# Altium schematic sheet SCH_BTL.SchDoc
size A; SheetNumber: 1; SheetTotal: 1
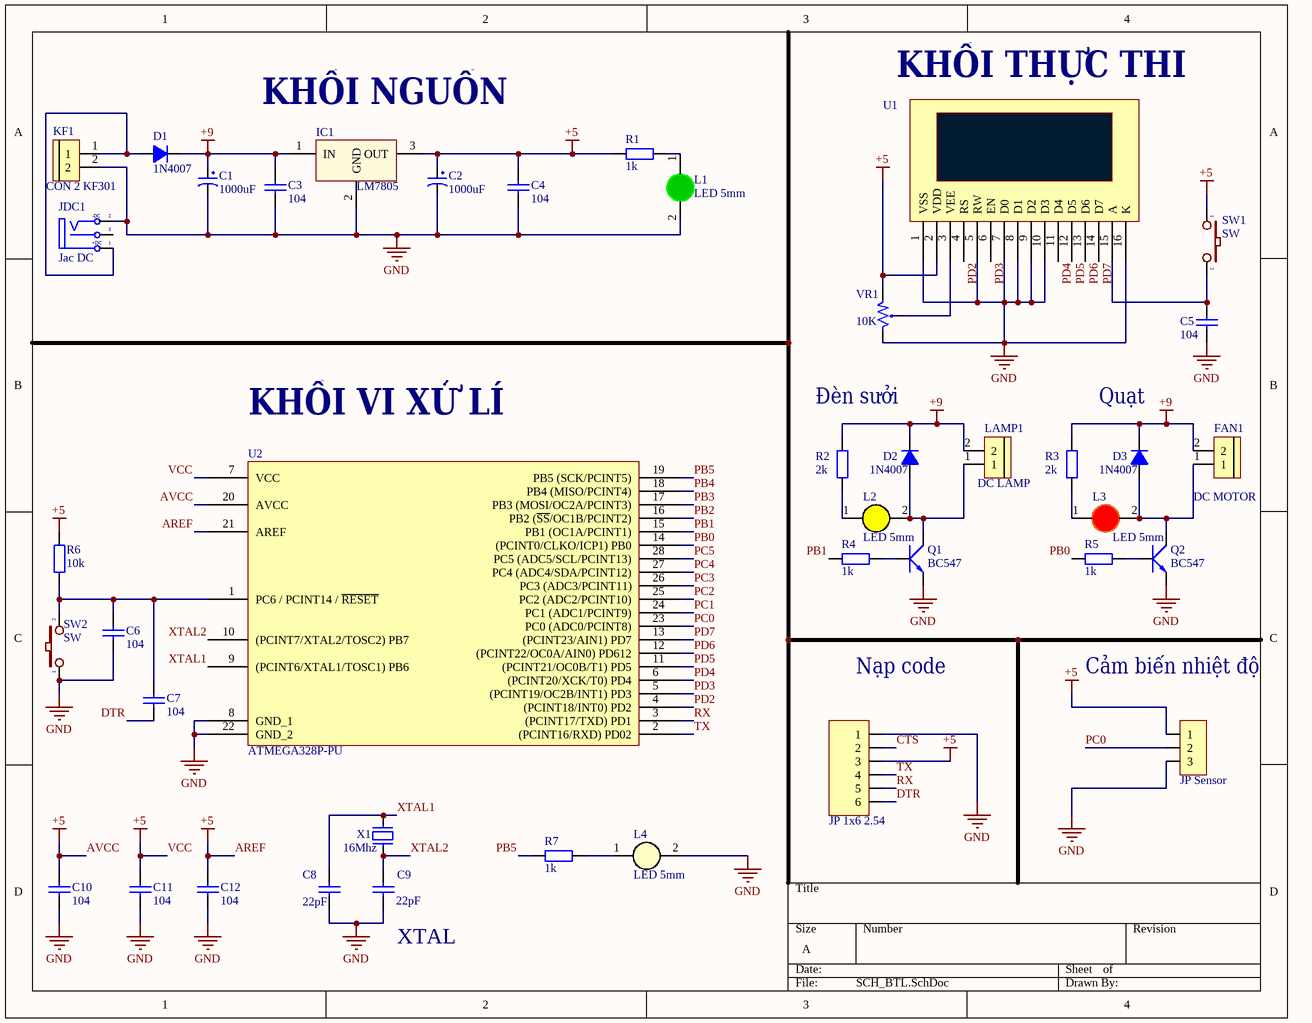
[diagram p0: SCH_BTL.SchDoc]

## Parts
C1  1000uF  [tu hoa 8mm]
C2  1000uF  [tu hoa 8mm]
C3  104  [tu gom]
C4  104  [tu gom]
C5  104  [tu gom]
C6  104  [tu gom]
C7  104  [tu gom]
C8  22pF  [tu gom]
C9  22pF  [tu gom]
C10  104  [tu gom]
C11  104  [tu gom]
C12  104  [tu gom]
D1  1N4007  [D1A]
D2  1N4007  [D1A]
D3  1N4007  [D1A]
FAN1  DC MOTOR  [Con 2 KF301 5.08]
IC1  LM7805  [QTO-220]
JDC1  Jac DC  [DC-IN]
JP1  JP 1x6 2.54  [JP 1x6 CC]
JP2  JP Sensor  [JP 1x3 CT]
KF1  CON 2 KF301  [Con 2 KF301 5.08]
L1  LED 5mm  [LED-5MM-Green]
L2  LED 5mm  [LED-5MM-Yellow]
L3  LED 5mm  [LED-5MM-RED]
L4  LED 5mm  [LED-5MM-WHITE]
LAMP1  DC LAMP  [Con 2 KF301 5.08]
Q1  BC547  [TO92]
Q2  BC547  [TO92]
R1  1k  [tro vach 1/4w]
R2  2k  [tro vach 1/4w]
R3  2k  [tro vach 1/4w]
R4  1k  [tro vach 1/4w]
R5  1k  [tro vach 1/4w]
R6  10k  [tro vach 1/4w]
R7  1k  [tro vach 1/4w]
SW1  SW  [SW2]
SW2  SW  [SW2]
U1  LCD  [LCD16X2]  (value not drawn)
U2  ATMEGA328P-PU  [27_DIP_7.62mm]
VR1  10K  [VR1]
X1  16Mhz  [XT2]

## Nets
+9: C1.1 C3.1 D1.2(K) D2.2(K) D3.2(K) FAN1.2 IC1.1(IN) LAMP1.2 R2.1 R3.1
AREF: C2.1 C4.1 C10.1 C11.1 C12.1 IC1.3(OUT) JP1.3 JP2.1 R1.2 R6.2 SW1.1 U1.2(VDD) U2.7(VCC) U2.20(AVCC) U2.21(AREF) VR1.1  [also labelled +5, AVCC, VCC]
GND: C1.2 C2.2 C3.2 C4.2 C5.2 C6.2 C8.2 C9.2 C10.2 C11.2 C12.2 IC1.2(GND) JDC1.2(TN) JP1.1 JP2.3 KF1.2 L1.2(K) L4.2(K) Q1.1(E) Q2.1(E) SW2.1 U1.1(VSS) U1.5(RW) U1.7(D0) U1.8(D1) U1.9(D2) U1.10(D3) U1.16(K) U2.8(GND_1) U2.22(GND_2) VR1.3
CTS: JP1.2
DTR: C7.1 JP1.6
PB0: R5.1 U2.14((PCINT0/CLKO/ICP1)_PB0)
PB1: R4.1 U2.15(PB1_(OC1A/PCINT1))
PB2: U2.16(PB2_(~{SS}/OC1B/PCINT2))
PB3: U2.17(PB3_(MOSI/OC2A/PCINT3))
PB4: U2.18(PB4_(MISO/PCINT4))
PB5: R7.2 U2.19(PB5_(SCK/PCINT5))
PC0: JP2.2 U2.23(PC0_(ADC0/PCINT8))
PC1: U2.24(PC1_(ADC1/PCINT9))
PC2: U2.25(PC2_(ADC2/PCINT10))
PC3: U2.26(PC3_(ADC3/PCINT11))
PC4: U2.27(PC4_(ADC4/SDA/PCINT12))
PC5: U2.28(PC5_(ADC5/SCL/PCINT13))
PD2: U1.4(RS) U2.4((PCINT18/INT0)_PD2)
PD3: U1.6(EN) U2.5((PCINT19/OC2B/INT1)_PD3)
PD4: U1.11(D4) U2.6((PCINT20/XCK/T0)_PD4)
PD5: U1.12(D5) U2.11((PCINT21/OC0B/T1)_PD5)
PD6: U1.13(D6) U2.12((PCINT22/OC0A/AIN0)_PD612)
PD7: U1.14(D7) U2.13((PCINT23/AIN1)_PD7)
RX: JP1.5 U2.3((PCINT17/TXD)_PD1)
TX: JP1.4 U2.2((PCINT16/RXD)_PD02)
XTAL1: C8.1 U2.9((PCINT6/XTAL1/TOSC1)_PB6) X1.2
XTAL2: C9.1 U2.10((PCINT7/XTAL2/TOSC2)_PB7) X1.1
NetC5_1: C5.1 SW1.2 U1.15(A)
NetC6_1: C6.1 C7.2 R6.1 SW2.2 U2.1(PC6_/_PCINT14_/_~{RESET})
NetD1_1: D1.1(A) JDC1.1(T) KF1.1
NetD2_1: D2.1(A) L2.2(K) LAMP1.1 Q1.3(C)
NetD3_1: D3.1(A) FAN1.1 L3.2(K) Q2.3(C)
NetL1_1: L1.1(A) R1.1
NetL2_1: L2.1(A) R2.2
NetL3_1: L3.1(A) R3.2
NetL4_1: L4.1(A) R7.1
NetQ1_2: Q1.2(B) R4.2
NetQ2_2: Q2.2(B) R5.2
NetU1_3: U1.3(VEE) VR1.2

Not connected (* = marked no-connect by the designer): JDC1 3(S)

## Notes on the sheet
- KHỐI THỰC THI
- KHỐI NGUỒN
- KHỐI VI XỬ LÍ
- Đèn sưởi
- Quạt
- Nạp code
- Cảm biến nhiệt độ
- (near C9) XTAL
- Labels drawn without touching a wire or pin: \
- (in symbol DCIN) -DC; +DC

## Library data of the parts
C1 C2 = Tu Hoa 1000uF 16V 8x20: Cắm; Don_Vi: Con; So_Chan: 2; Ten_Linh_Kien: Tụ Hóa 1000uF 16V 8x20MM; Ma_Hang: MH008300; Chung_Loai: Cắm; Kieu_Chan: *
C3 C4 C7 = Tu gom 104 50V: Cắm; So_Chan: 2; Ten_Linh_Kien: Tụ gốm 104 100nF 50V; Don_Vi: Con; Ma_Hang: MH004761; Chung_Loai: Cắm; Kieu_Chan: *
C5 C6 C10-C12 = Tu gom 101 50V: Cắm; Don_Vi: Con; So_Chan: 2; Ten_Linh_Kien: Tụ gốm 101 0.1nF 50V; Ma_Hang: MH004764; Chung_Loai: Cắm; Kieu_Chan: *
C8 C9 = Tu gom 22pF 50V: Cắm; Don_Vi: Con; So_Chan: 2; Ten_Linh_Kien: Tụ gốm 22P 50V; Ma_Hang: MH004771; Chung_Loai: Cắm; Kieu_Chan: *
D1-D3 = D1A: Diode 1A; Value: 1N4007
FAN1 LAMP1 = CON 2 KF301: Cắm; Ma_Hang: MH000987; Ten_Linh_Kien: CON 2 KF301-2P 5.08MM Xanh Dương; Don_Vi: Con; Chung_Loai: Cắm; Ghi_Chu: *; Kieu_Chan: *
IC1 = LM78xx: On ap +, from + 5 to + 24VDC; Value: LM7805
JDC1 = DCIN: Jac DC input; Value: Jac DC
JP1 = JP 1x6 2.54 Cai Cong: Cắm; Ten_Linh_Kien: Jump Đơn Cái 2.54MM 1x40P Cong; Don_Vi: Con; Ma_Hang: MH001265; Ghi_Chu: *; Kieu_Chan: *; Chung_Loai: Cắm
JP2 = JP 1x3 2.54 Cai Thang: Cắm; Ten_Linh_Kien: Jump Đơn Cái 2.54MM 1x20P Thẳng; Don_Vi: Con; Ma_Hang: MH004006; Ghi_Chu: *; Kieu_Chan: *; Chung_Loai: Cắm
KF1 = CON 2 KF301: Cắm; Ma_Hang: MH000987; Ten_Linh_Kien: CON 2 KF301-2P 5.08MM Xanh Dương; Chung_Loai: Cắm; Ghi_Chu: *; Kieu_Chan: *; Don_Vi: Con
L1 = LED 5mm Xanh La: Cắm; Don_Vi: Con; Ma_Hang: MH008969; Ten_Linh_Kien: LED 5MM Phủ Xanh (1000c); Ghi_Chu: *; Kieu_Chan: *; Chung_Loai: Cắm
L2 = LED 5mm Vang: Cắm; Don_Vi: Con; Ma_Hang: MH008968; Ten_Linh_Kien: Led 5MM Phủ Vàng (1000c); Ghi_Chu: *; Kieu_Chan: *; Chung_Loai: Cắm
L3 = LED 5mm Do: Cắm; Don_Vi: Con; Ma_Hang: MH008967; Ten_Linh_Kien: Led 5MM Phủ Đỏ (1000c); Ghi_Chu: *; Kieu_Chan: *; Chung_Loai: Cắm
L4 = LED 5mm Trang: Cắm; Don_Vi: Con; Ma_Hang: MH008983; Ten_Linh_Kien: Led 5MM Trắng Đục (1000c); Ghi_Chu: *; Kieu_Chan: *; Chung_Loai: Cắm
Q1 Q2 = Trans 2N3904: NPN transistor EBC; Value: C9014
R1-R5 R7 = Tro Vach 1/4W 5% 1k: Cắm; Don_Vi: Con; So_Chan: 2; Ten_Linh_Kien: Trở Vạch 1/4w 5% 1k; Ma_Hang: MH007390; Chung_Loai: Cắm; Kieu_Chan: *
R6 = Tro Vach 1/4W 5% 10k: Căm; Chung_Loai: Cắm; Don_Vi: Con; So_Chan: 2; Ten_Linh_Kien: Trở Vạch 1/4w 5% 10K; Ma_Hang: MH007354; Kieu_Chan: *
SW1 SW2 = SW2: Switch button 2 pin; Value: SW chip 2 pin
U1 = LCD: Value: LCD16x2
U2 = ATMEGA328P-PU: ATMEGA328P-PU; 8 bit Microcontroller AVR 20MHz 1; 32kb Flash; 2kb RAM; I2C SPI 2; Manufacturer: Microchip / Atmel; Number of PWM Channels: 6; Number of Timers/Counters: 3; Min Supply Voltage: 1.8V; Max Supply Voltage: 5.5V; Interface: I2C,SPI,UART,USART,2-Wire; Number of I/Os: 23; Oscillator Type: Internal; Data Bus Width: 8b; Number of SPI Channels: 1; Watchdog Timer: Yes; Peripherals: Brown-out Detect/Reset,POR,PWM,WDT; Manufacturer Part Number: ATMEGA328P-PU; RoHS: Yes; Category: Microcontrollers; Stock 1: 5280; Pricing 1: 1=2,08000, 25=1,91000, 100=1,73000 (USD); Mount: Through Hole; Case/Package: PDIP; Number of Pins: 28; Contact Plating: Tin,Matte; Min Operating Temperature: -40°C; Max Operating Temperature: 85°C; Package Quantity: 14; Core Architecture: AVR; RAM Size: 2KB; Number of ADC Channels: 6; Packaging: Rail/Tube; Frequency: 20MHz; Number of Programmable I/O: 23; Max Frequency: 20MHz; Number of I2C Channels: 1; Memory Type: FLASH; Memory Size: 32KB; Length: 37.4mm; Height: 3.28mm; Width: 6.76mm; Radiation Hardening: No; REACH SVHC: No SVHC; Lead Free: Lead Free; ComponentLink1URL: https://datasheet.ciiva.com/20168/73-4283-20168380.pdf?src-supplier=Rapid+Electronics; ComponentLink1Description: https://datasheet.ciiva.com/20168/73-4283-20168380.pdf?src-supplier=Rapid+Electronics; ComponentLink2URL: https://datasheet.ciiva.com/19457/2139111-19457070.pdf?src-supplier=Jameco; ComponentLink2Description: https://datasheet.ciiva.com/19457/2139111-19457070.pdf?src-supplier=Jameco; ComponentLink3URL: https://datasheet.ciiva.com/1157/1684409-1157696.pdf?src-supplier=Element14; ComponentLink3Description: https://datasheet.ciiva.com/1157/1684409-1157696.pdf?src-supplier=Element14; ComponentLink4URL: https://datasheet.ciiva.com/26818/atmega328p-pu-26818578.pdf?src-supplier=IIIC; ComponentLink4Description: https://datasheet.ciiva.com/26818/atmega328p-pu-26818578.pdf?src-supplier=IIIC; ComponentLink5URL: https://datasheet.ciiva.com/29119/155197-da-01-en-microcontr-atmega328p-pu-8bit-pdip-28-29119593.pdf?src-supplier=Conrad; ComponentLink5Description: https://datasheet.ciiva.com/29119/155197-da-01-en-microcontr-atmega328p-pu-8bit-pdip-28-29119593.pdf?src-supplier=Conrad; ComponentLink6URL: https://datasheet.ciiva.com/15213/getdatasheetpartid-318533-15213133.pdf?src-supplier=Verical; ComponentLink6Description: https://datasheet.ciiva.com/15213/getdatasheetpartid-318533-15213133.pdf?src-supplier=Verical; Supplier 1: Digi-Key; Supplier Part Number 1: ATMEGA328P-PU-ND
VR1 = VR1: Var Resistor; Value: VR 10K
X1 = XT2: Crystal For all Crystal 2pin.; Value: 4Mhz